# Altium schematic sheet pca20017_sensors.SchDoc: nRF52 Quadcopter - Sensors
size A4; Organization: Nordic Semiconductor; DocumentNumber: 3; Revision: 1.0.0; SheetNumber: 3; SheetTotal: 5; CompanyName: Nordic Semiconductor; DrawnBy: ERHE; ProjectNumber: 4425; DocumentSize: A4; PCAName: PCA20017; PCBRevision: 0002ERHE; PCBNumber: 400151; ProjectName: 4425
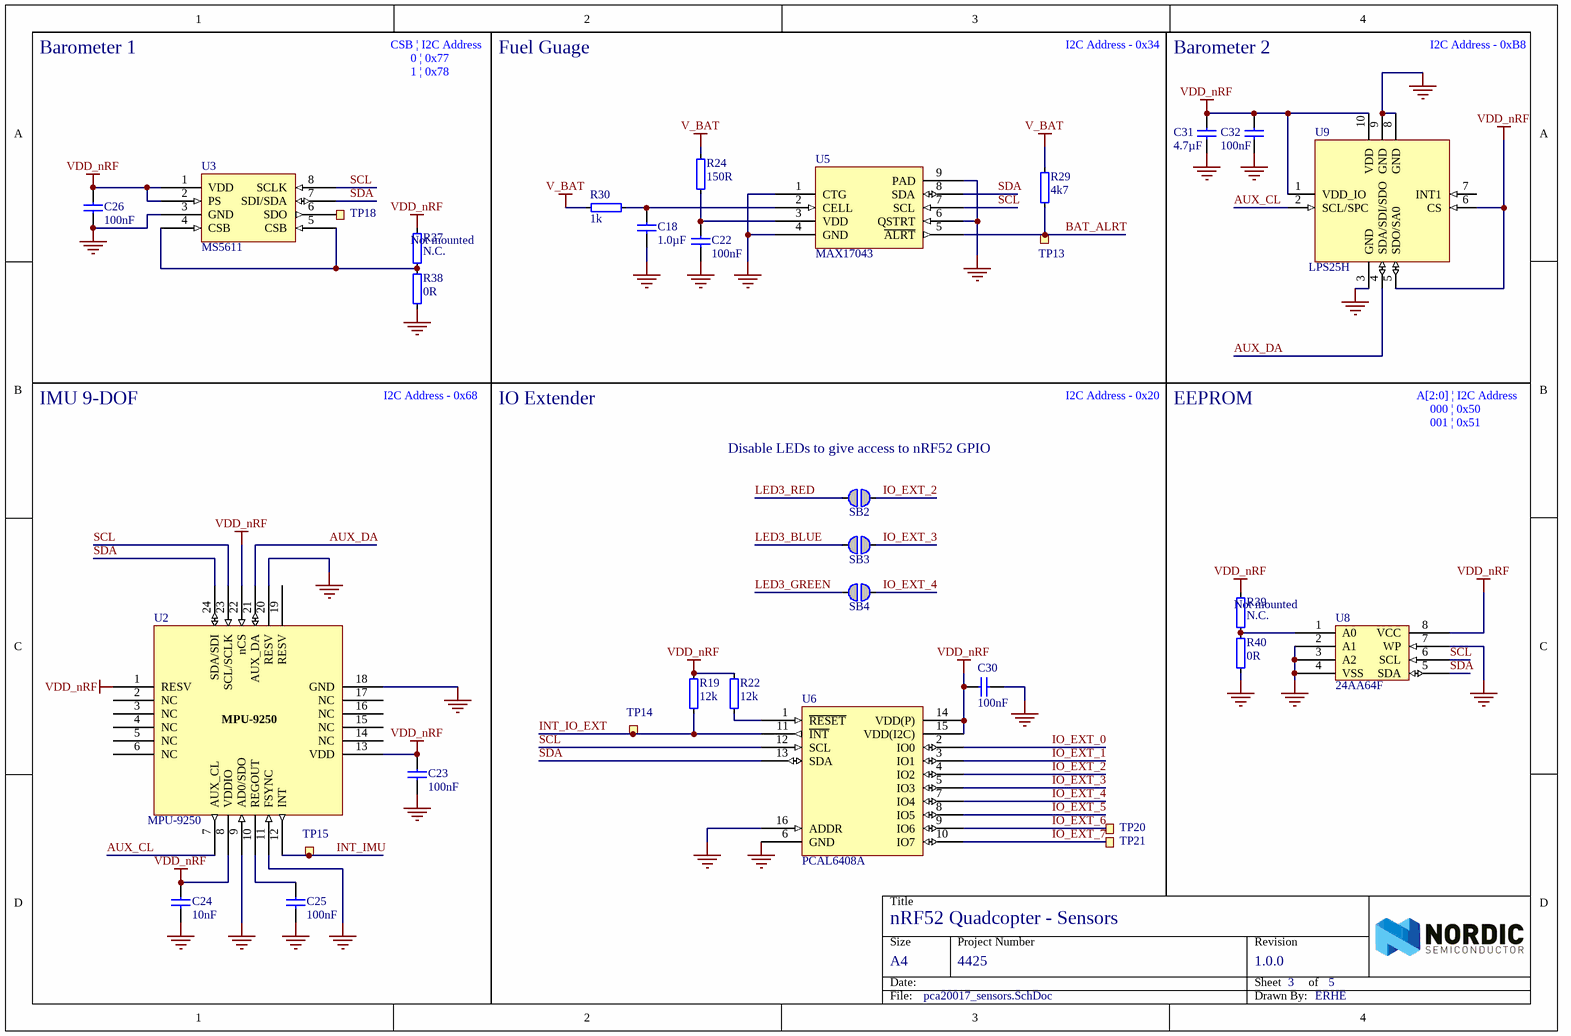
[diagram p0: pca20017_sensors.SchDoc]

## Parts
C18  1.0µF  [CAPC1005X04L]
C22  100nF  [CAPC1005X04L]
C23  100nF  [CAPC1005X04L]
C24  10nF  [CAPC1005X04L]
C25  100nF  [CAPC1005X04L]
C26  100nF  [CAPC1005X04L]
C30  100nF  [CAPC1005X04L]
C31  4.7µF  [CAPC1608X06L]
C32  100nF  [CAPC1005X04L]
R19  12k  [RESC1005X04L]
R22  12k  [RESC1005X04L]
R24  150R  [RESC1005X04L]
R29  4k7  [RESC1005X04L]
R30  1k  [RESC1005X04L]
R37  N.C.  Assembly: Not mounted  [RESC1005X04L]
R38  0R  [RESC1005X04L]
R39  N.C.  Assembly: Not mounted  [RESC1005X04L]
R40  0R  [RESC1005X04L]
SB2  Solderbridge  [Solderbridge]  (value not drawn)  (no BOM)
SB3  Solderbridge  [Solderbridge]  (value not drawn)  (no BOM)
SB4  Solderbridge  [Solderbridge]  (value not drawn)  (no BOM)
TP13  Ø1.0mm,SMD  [TP_SMD_Ø1.0mm]  (value not drawn)  (no BOM)
TP14  Ø1.0mm,SMD  [TP_SMD_Ø1.0mm]  (value not drawn)  (no BOM)
TP15  Ø1.0mm,SMD  [TP_SMD_Ø1.0mm]  (value not drawn)  (no BOM)
TP18  Ø1.0mm,SMD  [TP_SMD_Ø1.0mm]  (value not drawn)  (no BOM)
TP20  Ø1.0mm,SMD  [TP_SMD_Ø1.0mm]  (value not drawn)  (no BOM)
TP21  Ø1.0mm,SMD  [TP_SMD_Ø1.0mm]  (value not drawn)  (no BOM)
U2  MPU-9250  [QFN40P300X300X105_HS-25N]
U3  MS5611  [QFN125P300X500X100-8N]
U5  MAX17043  [MAX17043]
U6  PCAL6408A  [XQFN40P180X260X50-16N]
U8  24AA64F  [24AA64F]
U9  LPS25H  [HCLGA-10L (2.5x2.5x1.0mm)]

## Nets
GND: C18.1 C22.1 C23.1 C24.1 C25.1 C26.2 C30.1 C31.1 C32.1 R38.1 R40.1 U2.9(AD0/SDO) U2.11(FSYNC) U2.18(GND) U2.20(RESV) U3.3(GND) U5.1(CTG) U5.4(GND) U5.6(QSTRT) U5.9(PAD) U6.6(GND) U6.16(ADDR) U8.2(A1) U8.3(A2) U8.4(VSS) U8.7(WP) U9.3(GND) U9.8(GND) U9.9(GND)
V_BAT: R24.2 R29.2 R30.1
VDD_nRF: C23.2 C24.2 C26.1 C30.2 C31.2 C32.2 R19.2 R22.2 R37.2 R39.2 U2.1(RESV) U2.8(VDDIO) U2.13(VDD) U2.22(nCS) U3.1(VDD) U3.2(PS) U6.14(VDD(P)) U6.15(VDD(I2C)) U8.8(VCC) U9.1(VDD_IO) U9.5(SDO/SA0) U9.6(CS) U9.10(VDD)
AUX_CL: U2.7(AUX_CL) U9.2(SCL/SPC)
AUX_DA: U2.21(AUX_DA) U9.4(SDA/SDI/SDO)
BAT_ALRT: R29.1 TP13.1 U5.5(~{ALRT})
INT_IMU: TP15.1 U2.12(INT)
INT_IO_EXT: R19.1 TP14.1 U6.11(~{INT})
IO_EXT_0: U6.2(IO0)
IO_EXT_1: U6.3(IO1)
IO_EXT_2: SB2.2 U6.4(IO2)
IO_EXT_3: SB3.2 U6.5(IO3)
IO_EXT_4: SB4.2 U6.7(IO4)
IO_EXT_5: U6.8(IO5)
IO_EXT_6: TP20.1 U6.9(IO6)
IO_EXT_7: TP21.1 U6.10(IO7)
LED3_BLUE: SB3.1
LED3_GREEN: SB4.1
LED3_RED: SB2.1
SCL: U2.23(SCL/SCLK) U3.8(SCLK) U5.7(SCL) U6.12(SCL) U8.6(SCL)
SDA: U2.24(SDA/SDI) U3.7(SDI/SDA) U5.8(SDA) U6.13(SDA) U8.5(SDA)
NetC18_2: C18.2 R30.2 U5.2(CELL)
NetC22_2: C22.2 R24.1 U5.3(VDD)
NetC25_2: C25.2 U2.10(REGOUT)
NetR22_1: R22.1 U6.1(~{RESET})
NetR37_1: R37.1 R38.2 U3.4(CSB) U3.5(CSB)
NetR39_1: R39.1 R40.2 U8.1(A0)
NetTP18_1: TP18.1 U3.6(SDO)

Not connected (* = marked no-connect by the designer): U2 2(NC) 3(NC) 4(NC) 5(NC) 6(NC) 14(NC) 15(NC) 16(NC) 17(NC) 19(RESV); U9 7(INT1)

## Notes on the sheet
- Barometer 1
- CSB | I2C Address
- 0 | 0x77
- 1 | 0x78
- Fuel Guage
- I2C Address - 0x34
- Barometer 2
- I2C Address - 0xB8
- IMU 9-DOF
- I2C Address - 0x68
- IO Extender
- I2C Address - 0x20
- EEPROM
- A[2:0] | I2C Address
- 000 | 0x50
- 001 | 0x51
- (near SB2) Disable LEDs to give access to nRF52 GPIO
- Title
- Size
- Date:
- Project Number
- Sheet         of
- Revision
- File:
- Drawn By:

## Library data of the parts
C18 = C0402-1µ0: Capacitor, X5R, ±5%; Note: 6.3V; Artikkelnr Noca: 20039235; Artikkelnr Simpro: N.A.; Part Number: C0402-1µ0; Manufacturer: *; Manufacturer Part Number: *; Datasheet: *; Footprint Doc: 0402; LatestRevisionDate: 2009-11-23; Pin Count: 2; Publisher: Nordic Semiconductor; Published: 2009-05-08; Value: 1.0µF; Supplier: *; Supplier part number: *; 2nd source Supplier: *; 2nd source part number: *
C22 C23 C25 C26 C30 C32 = C0402-100n: Capacitor, X7R, ±10%; Note: 16V; Artikkelnr Noca: 20039200; Artikkelnr Simpro: N.A.; Part Number: C0402-100n; Manufacturer: *; Manufacturer Part Number: *; Datasheet: *; Footprint Doc: 0402; LatestRevisionDate: 2009-11-23; Pin Count: 2; Publisher: Nordic Semiconductor; Published: 2009-05-08; Value: 100nF; Supplier: *; Supplier part number: *; 2nd source Supplier: *; 2nd source part number: *
C24 = C0402-10n: Capacitor, X7R, ±10%; Note: 16V; Artikkelnr Noca: 20039166; Artikkelnr Simpro: N.A.; Part Number: C0402-10n; Manufacturer: *; Manufacturer Part Number: *; Datasheet: *; Footprint Doc: 0402; LatestRevisionDate: 2009-11-23; Pin Count: 2; Publisher: Nordic Semiconductor; Published: 2009-05-08; Value: 10nF; Supplier: *; Supplier part number: *; 2nd source Supplier: *; 2nd source part number: *
C31 = C0603-4µ7: Capacitor, X5R, ±10%; Note: 6.3V; Artikkelnr Noca: 20069060; Artikkelnr Simpro: N.A.; Part Number: C0603-4µ7; Manufacturer: *; Manufacturer Part Number: *; Datasheet: *; Footprint Doc: 0603; LatestRevisionDate: 2009-11-23; Pin Count: 2; Publisher: Nordic Semiconductor; Published: 2009-05-08; Value: 4.7µF; Supplier: *; Supplier part number: *; 2nd source Supplier: *; 2nd source part number: *
R19 R22 = R0402-12k: Resistor, ±1%, 0.063W; Note: Chip Res 1%; Artikkelnr Noca: 27049099; Artikkelnr Simpro: N.A.; Value Ohm: 12000; Part Number: R0402-12k; Manufacturer: *; Manufacturer Part Number: *; Datasheet: *; Footprint Doc: 0402; LatestRevisionDate: 2009-11-23; Pin Count: 2; Publisher: Nordic Semiconductor; Published: 2009-05-08; Value: 12k; Supplier: Farnell; Supplier part number: 173-8865; 2nd source Supplier: *; 2nd source part number: *
R24 = R0402-150: Resistor, ±1%, 0.063W; Note: Chip Res 1%; Artikkelnr Noca: 27049053; Artikkelnr Simpro: N.A.; Value Ohm: 150; Part Number: R0402-150; Manufacturer: *; Manufacturer Part Number: *; Datasheet: *; Footprint Doc: 0402; LatestRevisionDate: 2009-11-23; Pin Count: 2; Publisher: Nordic Semiconductor; Published: 2009-05-08; Value: 150R; Supplier: Farnell; Supplier part number: 173-8839; 2nd source Supplier: *; 2nd source part number: *
R29 = R0402-4k7: Resistor, ±1%, 0.063W; Note: Chip Res 1%; Artikkelnr Noca: 27049089; Artikkelnr Simpro: N.A.; Value Ohm: 4700; Part Number: R0402-4k7; Manufacturer: *; Manufacturer Part Number: *; Datasheet: *; Footprint Doc: 0402; LatestRevisionDate: 2009-11-23; Pin Count: 2; Publisher: Nordic Semiconductor; Published: 2009-05-08; Value: 4k7; Supplier: Farnell; Supplier part number: 173-8858; 2nd source Supplier: *; 2nd source part number: *
R30 = R0402-1k0: Resistor, ±1%, 0.063W; Note: Chip Res 1%; Artikkelnr Noca: 27049073; Artikkelnr Simpro: N.A.; Value Ohm: 1000; Part Number: R0402-1k0; Manufacturer: *; Manufacturer Part Number: *; Datasheet: *; Footprint Doc: 0402; LatestRevisionDate: 2009-11-23; Pin Count: 2; Publisher: Nordic Semiconductor; Published: 2009-05-08; Value: 1k; Supplier: Farnell; Supplier part number: 173-8850; 2nd source Supplier: *; 2nd source part number: *
R37 R39 = R0402-N.C.: Not mounted; Note: Chip Res; Artikkelnr Noca: N.A.; Part Number: R0402-N.C.; Manufacturer: *; Manufacturer Part Number: *; Datasheet: *; Footprint Doc: 0402; LatestRevisionDate: 2009-05-08; Pin Count: 2; Publisher: Nordic Semiconductor; Published: 2009-05-08; Value: N.C.; Supplier: *; Supplier part number: *; 2nd source Supplier: *; 2nd source part number: *; Artikkelnr Simpro: N.A.
R38 R40 = R0402-0R: Resistor, ±5%, 0.063W; Note: Chip Res 5%; Artikkelnr Noca: 27049000; Artikkelnr Simpro: N.A.; Value Ohm: 0; Part Number: R0402-0R; Manufacturer: *; Manufacturer Part Number: *; Datasheet: *; Footprint Doc: 0402; LatestRevisionDate: 2009-11-23; Pin Count: 2; Publisher: Nordic Semiconductor; Published: 2009-05-08; Value: 0R; Supplier: Farnell; Supplier part number: 146-9661; 2nd source Supplier: *; 2nd source part number: *
SB2-SB4 = Solderbridge: Artikkelnr Noca: N.A.; Part Number: Solderbridge; Manufacturer: *; Manufacturer Part Number: *; Datasheet: *; Footprint Doc: Solderbridge; LatestRevisionDate: 2009-12-14; Pin Count: 2; Publisher: Nordic Semiconductor; Published: 2009-12-14; Value: Solderbridge; Note: *; Supplier: *; Supplier part number: *; 2nd source Supplier: *; 2nd source part number: *; Artikkelnr Simpro: N.A.
TP13-TP15 TP18 TP20 TP21 = TP_SMD_Ø1.0MM: 1.0mm circular SMD testpad; Manufacturer: Nordic Semiconductor; Artikkelnr Noca: N.A.; Part Number: TP_SMD_Ø1.0MM; Manufacturer Part Number: *; Datasheet: *; Footprint Doc: TP_SMD_Ø1.0mm; LatestRevisionDate: 2013-06-11; Pin Count: 1; Publisher: Nordic Semiconductor; Published: 2013-06-11; Value: Ø1.0mm,SMD; Note: *; Supplier: *; Supplier part number: *; 2nd source Supplier: *; 2nd source part number: *; Artikkelnr Simpro: N.A.
U2 = MPU-9250: 9-axis MotionTracking™ Device; Manufacturer: InvenSense; Note: 3-Axis Gyro, 3-Axis Accel and 3-Axis Compass; Artikkelnr Noca: N.A.; Part Number: MPU-9250; Manufacturer Part Number: MPU-9250; Datasheet: http://43zrtwysvxb2gf29r5o0athu.wpengine.netdna-cdn.com/wp-content/uploads/2015/02/MPU-9250-Datasheet.pdf; Footprint Doc: QFN-24; LatestRevisionDate: 2015-06-24; Pin Count: 24; Publisher: Nordic Semiconductor; Published: 2015-06-24; Value: MPU-9250; Supplier: Digi-Key; Supplier part number: 1428-1019-1-ND; 2nd source Supplier: *; 2nd source part number: *; Artikkelnr Simpro: N.A.
U3 = MS5611-01BA03: Accurate Pressure/Altitude and Temperature sensor with I2C and SPI interface; Manufacturer: Measurement Specialties; Manufacturer Part Number: MS561101BA03-50; 2nd source part number: 824-MS561101BA03-50; Note: MEASUREMENT SPECIALTIES  MS561101BA03-50  SENSOR, BAROMETRIC, 0.01-1.2BAR, QFN-8; Artikkelnr Noca: N.A.; Part Number: MS5611-01BA03; Datasheet: http://www.meas-spec.com/downloads/MS5611-01BA03.pdf; Footprint Doc: QFN-8; LatestRevisionDate: 2015-06-24; Pin Count: 8; Publisher: Nordic Semiconductor; Published: 2015-06-24; Value: MS5611-01BA03; Supplier: Farnell; Supplier part number: 2362662; 2nd source Supplier: Mouser; Artikkelnr Simpro: N.A.
U5 = MAX17043: IC FUEL FUAGE LI-ION; Manufacturer: Maxim; Manufacturer Part Number: MAX17043G+U; 2nd source part number: 700-MAX17043G+U; Note: Compact, Low-Cost 1S/2S Fuel Gauges with Low-Battery Alert; Artikkelnr Noca: N.A.; Part Number: MAX17043; Datasheet: http://www.mouser.com/ds/2/256/MAX17043-MAX17044-44624.pdf; Footprint Doc: TDFN-8L-2x3mm; LatestRevisionDate: 2015-06-24; Pin Count: 8; Publisher: Nordic Semiconductor; Published: 2015-06-24; Value: MAX17043; Supplier: *; Supplier part number: *; 2nd source Supplier: Mouser; Artikkelnr Simpro: N.A.
U6 = PCAL6408AHK: 8-bit I2C-bus I/O expander with interrupt output; Manufacturer: NXP Semiconductors; 2nd source part number: 771-PCAL6408AHKX; Artikkelnr Noca: N.A.; Part Number: PCAL6408AHK; Manufacturer Part Number: PCAL6408AHK; Datasheet: http://www.nxp.com/documents/data_sheet/PCAL6408A.pdf; Footprint Doc: XQFN-16; LatestRevisionDate: 2015-04-29; Pin Count: 16; Publisher: Nordic Semiconductor; Published: 2015-04-29; Value: PCAL6408A; Note: *; Supplier: Digi-Key; Supplier part number: 568-9944-2-ND; 2nd source Supplier: Mouser; Artikkelnr Simpro: N.A.
U8 = 24AA64F: IC EEPROM 64K with I2C interface TDFN-8; Manufacturer: Microchip; Manufacturer Part Number: 24AA64T-I/MNY; Artikkelnr Noca: N.A.; Part Number: 24AA64F; Datasheet: http://ww1.microchip.com/downloads/en/DeviceDoc/21189T.pdf; Footprint Doc: TDFN-8; LatestRevisionDate: 2015-06-30; Pin Count: 8; Publisher: Nordic Semiconductor; Published: 2015-06-30; Value: 24AA64F; Note: EEPROM 64K with I2C interface; Supplier: Digi-Key; Supplier part number: 24AA64T-I/MNYCT-ND; 2nd source Supplier: *; 2nd source part number: *; Artikkelnr Simpro: N.A.
U9 = LPS25H (NRND): MEMS pressure sensor: 260-1260 hPa absolute digital output barometer; Manufacturer: STMicroelectronics; 2nd source part number: 511-LPS25HTR; Artikkelnr Noca: N.A.; Part Number: LPS25H (NRND); Manufacturer Part Number: LPS25H; Datasheet: http://www.st.com/st-web-ui/static/active/en/resource/technical/document/datasheet/DM00066332.pdf; Footprint Doc: HCLGA-10L; LatestRevisionDate: 2014-08-21; Pin Count: 10; Publisher: Nordic Semiconductor; Published: 2014-08-21; Value: LPS25H; Note: *; Supplier: Digi-Key; Supplier part number: 497-14380-1-ND; 2nd source Supplier: Mouser; Artikkelnr Simpro: N.A.